# Altium schematic sheet Power.SchDoc
size A4; Organization: Altium Limited; Address1: 3 Minna Close; Address2: Belrose; Address3: NSW 2085; Address4: Australia
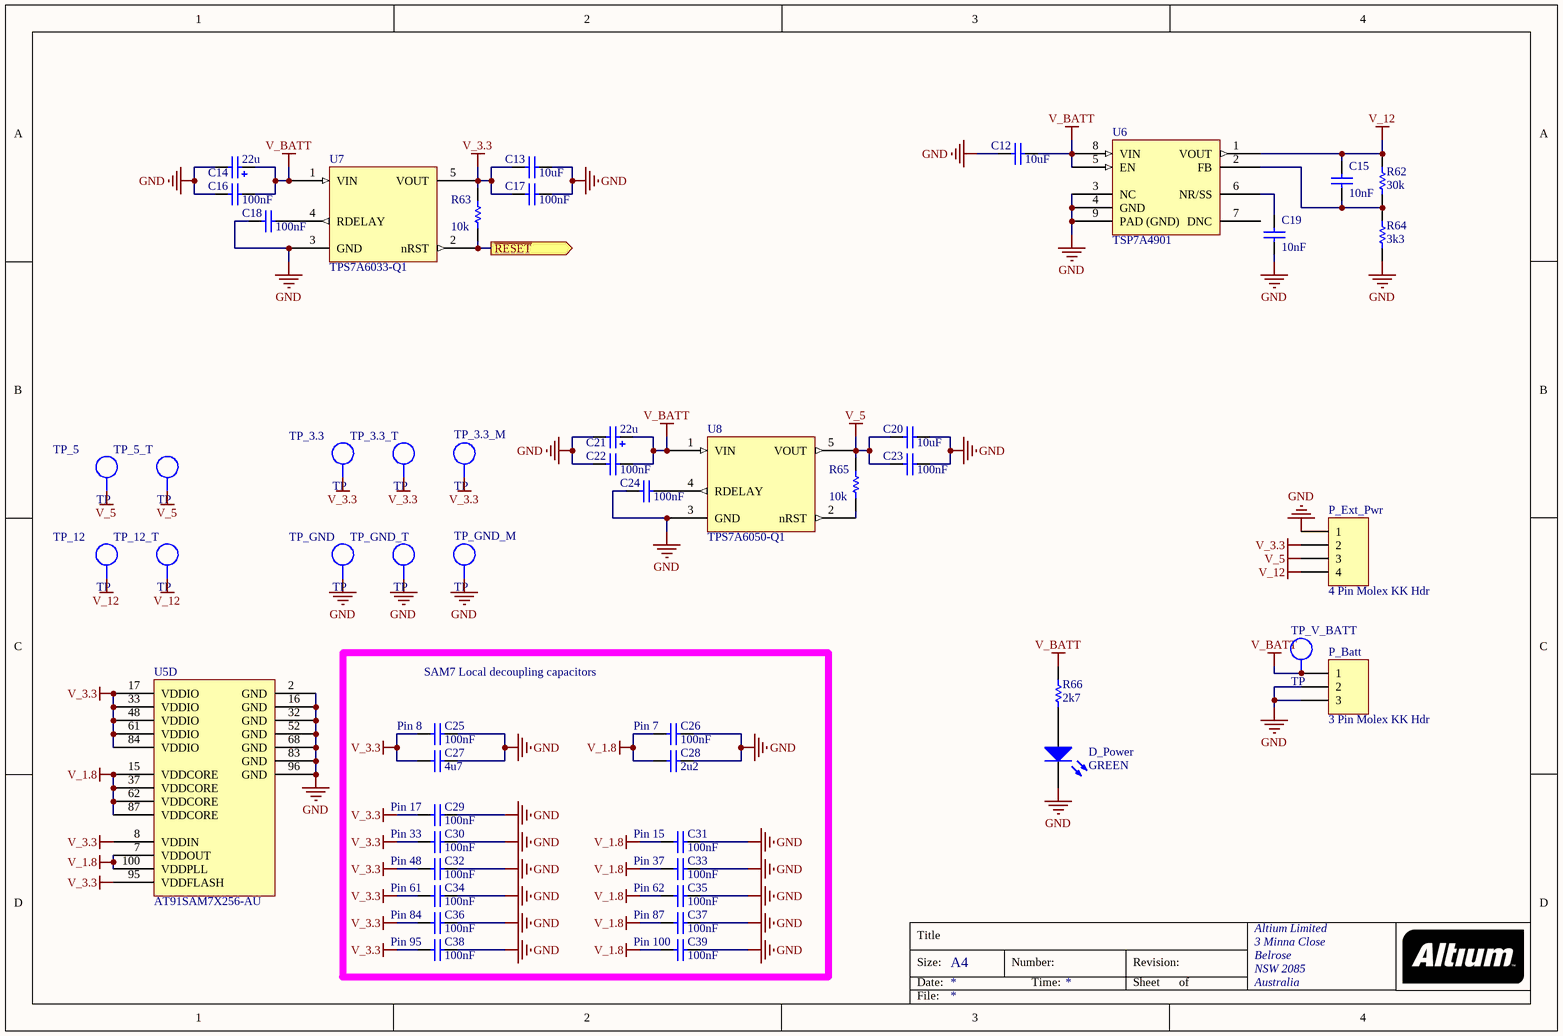
[diagram p0: Power.SchDoc]

## Parts
C12  10uF  [0805]
C13  10uF  [0805]
C14  value 22u  [6032]  (hidden comment: CP_TANT_22uF)
C15  10nF  [0603]
C16  100nF  [0603]
C17  100nF  [0603]
C18  100nF  [0603]
C19  10nF  [0603]
C20  10uF  [0805]
C21  value 22u  [6032]  (hidden comment: CP_TANT_22uF)
C22  100nF  [0603]
C23  100nF  [0603]
C24  100nF  [0603]
C25  100nF  [0603]
C26  100nF  [0603]
C27  4u7  [0603]
C28  2u2  [0603]
C29  100nF  [0603]
C30  100nF  [0603]
C31  100nF  [0603]
C32  100nF  [0603]
C33  100nF  [0603]
C34  100nF  [0603]
C35  100nF  [0603]
C36  100nF  [0603]
C37  100nF  [0603]
C38  100nF  [0603]
C39  100nF  [0603]
D_Power  value GREEN  [DIODE_0805]  (hidden comment: LED Green)
P_Batt  3 Pin Molex KK Hdr  [G_MOLEX_KK_3_HDR]
P_Ext_Pwr  4 Pin Molex KK Hdr  [G_MOLEX_KK_4_HDR]
R62  30k  [0603]
R63  10k  [0603]
R64  3k3  [0603]
R65  10k  [0603]
R66  2k7  [0603]
TP_3.3  TP  [TEST_POINT_4X2MM]  (no BOM)
TP_3.3_M  TP  [TEST_POINT_4X2MM]  (no BOM)
TP_3.3_T  TP  [TEST_POINT_4X2MM]  (no BOM)
TP_5  TP  [TEST_POINT_4X2MM]  (no BOM)
TP_5_T  TP  [TEST_POINT_4X2MM]  (no BOM)
TP_12  TP  [TEST_POINT_4X2MM]  (no BOM)
TP_12_T  TP  [TEST_POINT_4X2MM]  (no BOM)
TP_GND  TP  [TEST_POINT_4X2MM]  (no BOM)
TP_GND_M  TP  [TEST_POINT_4X2MM]  (no BOM)
TP_GND_T  TP  [TEST_POINT_4X2MM]  (no BOM)
TP_V_BATT  TP  [TEST_POINT_4X2MM]  (no BOM)
U5  AT91SAM7X256-AU  [LQFP100_N]  (part D of 4)
U6  TSP7A4901  [TSOP65P490X110_HS-8N]
U7  TPS7A6033-Q1  [TO170P1524X483-6N]
U8  TPS7A6050-Q1  [TO170P1524X483-6N]

## Ports
~{RESET} (out)

## Nets
GND: C12.1 C13.2 C14.2 C16.1 C17.1 C18.1 C19.1 C20.2 C21.2 C22.1 C23.1 C24.1 C25.2 C26.2 C27.2 C28.2 C29.2 C30.2 C31.2 C32.2 C33.2 C34.2 C35.2 C36.2 C37.2 C38.2 C39.2 D_Power.2(K) P_Batt.2 P_Batt.3 P_Ext_Pwr.1 R64.1 TP_GND.1 TP_GND_M.1 TP_GND_T.1 U5.2(GND) U5.16(GND) U5.32(GND) U5.52(GND) U5.68(GND) U5.83(GND) U5.96(GND) U6.3(NC) U6.4(GND) U6.9(PAD_(GND)) U7.3(GND) U8.3(GND)
V_1.8: C26.1 C28.1 C31.1 C33.1 C35.1 C37.1 C39.1 U5.7(VDDOUT) U5.15(VDDCORE) U5.37(VDDCORE) U5.62(VDDCORE) U5.87(VDDCORE) U5.100(VDDPLL)
V_3.3: C13.1 C17.2 C25.1 C27.1 C29.1 C30.1 C32.1 C34.1 C36.1 C38.1 P_Ext_Pwr.2 R63.2 TP_3.3.1 TP_3.3_M.1 TP_3.3_T.1 U5.8(VDDIN) U5.17(VDDIO) U5.33(VDDIO) U5.48(VDDIO) U5.61(VDDIO) U5.84(VDDIO) U5.95(VDDFLASH) U7.5(VOUT)
V_5: C20.1 C23.2 P_Ext_Pwr.3 R65.2 TP_5.1 TP_5_T.1 U8.5(VOUT)
V_12: C15.2 P_Ext_Pwr.4 R62.2 TP_12.1 TP_12_T.1 U6.1(VOUT)
V_BATT: C12.2 C14.1 C16.2 C21.1 C22.2 P_Batt.1 R66.2 TP_V_BATT.1 U6.5(EN) U6.8(VIN) U7.1(VIN) U8.1(VIN)
~{RESET}: R63.1 U7.2(nRST) ; port ~{RESET}
NetC15_1: C15.1 R62.1 R64.2 U6.2(FB)
NetC18_2: C18.2 U7.4(RDELAY)
NetC19_2: C19.2 U6.6(NR/SS)
NetC24_2: C24.2 U8.4(RDELAY)
NetD_Power_1: D_Power.1(A) R66.1
NetR65_1: R65.1 U8.2(nRST)

Not connected (* = marked no-connect by the designer): U6 7(DNC)

## Notes on the sheet
- SAM7 Local decoupling capacitors
- (near C25) Pin 8
- (near C26) Pin 7
- (near C29) Pin 17
- (near C30) Pin 33
- (near C31) Pin 15
- (near C32) Pin 48
- (near C34) Pin 61
- (near C36) Pin 84
- (near C33) Pin 37
- (near C35) Pin 62
- (near C37) Pin 87
- (near C38) Pin 95
- (near C39) Pin 100
- Title
- Size:
- Date:
- A4
- Number:
- Time:
- Revision:
- Sheet
- of
- File:

## Library data of the parts
C12 C13 C20 = CP_10uF 0805: CAP 10uF 10% 10V X5R 0805; Manufacturer: Murata; Manufacturer PN: GRM219R61A106KE44D; LatestRevisionDate: 29 May 08; Supplier 1: Digi-Key; Supplier Part Number 1: 490-4735-1-ND; Value: 10uF; Part Number: CP_10uF 0805; Component Kind: Standard; Component Type: Standard; Designator: CP_10uF 0805; Pin Count: 2
C14 C21 = CP_TANT_22uF_35V: CAP TANT 22UF 35V 10% SMD; Manufacturer: Vishay; Manufacturer PN: 293D226X9035D2TE3; Verify: NOT CHECKED; Signal Integrity: Cap Pol; Latest Revision Date: 20 Feb 09; Supplier 1: Digi-Key; Supplier Part Number 1: 718-1071-1-ND; Part Number: CP_TANT_22uF_35V; Component Kind: Standard; Component Type: Standard; Designator: CP_TANT_22uF_35V; Pin Count: 2; Simulation: CAP
C15 C19 = CP_10nF 0603: CAP CER 10000PF 100V X7R 0603; Manufacturer: Taiyo Yuden; Manufacturer PN: HMK107B7103KA-T; Supplier 1: Digi-Key; Supplier Part Number 1: 587-1446-2-ND; Value: 10nF; Part Number: CP_10nF 0603; Component Kind: Standard; Component Type: Standard; Designator: CP_10nF 0603; Pin Count: 2; Signal Integrity: Cap; Simulation: CAP
C16-C18 C22-C26 C29-C39 = CP_100nF 0603: CAP CER .10UF 50V X5R 0603; Manufacturer: Taiyo Yuden; Manufacturer PN: UMK107B7104KA-T; Value: 100nF; Part Number: CP_100nF 0603; Component Kind: Standard; Component Type: Standard; Designator: CP_100nF 0603; Pin Count: 2; LatestRevisionDate: 29 May 08; Supplier 1: Digi-Key; Supplier Part Number 1: 478-6206-1-ND; Signal Integrity: Cap; Simulation: CAP
C27 = CP_4u7 0603: CAP CER 4.7UF 10V X5R 0603; Manufacturer: Taiyo Yuden LMK107BJ475KA-T; Value: 4u7; Part Number: CP_4u7 0603; Component Kind: Standard; Component Type: Standard; Designator: CP_4u7 0603; Pin Count: 2; LatestRevisionDate: 29 May 08; Supplier 1: Digi-Key; Supplier Part Number 1: 587-1441-1-ND; Simulation: CAP
C28 = CP_2u2F_10V_0603: CAP CER 2.2UF 10V 10% X5R 0603; Manufacturer: Murata Electronics North America; Manufacturer PN: GRM188R61A225KE34D; Verify: not verified; Value: 2u2; Part Number: CP_2u2F_10V_0603; Component Kind: Standard; Component Type: Standard; Designator: CP_2u2F_10V_0603; Pin Count: 2; LatestRevisionDate: 20 Feb 08; Supplier 1: Digi-Key; Supplier Part Number 1: 490-1545-1-ND; Signal Integrity: Cap; Simulation: CAP
D_Power = DL_LED Green 0805: Green LED 0805; Manufacturer: Vishay; Verify: Not checked; Supplier 1: Digi-Key; Supplier Part Number 1: 160-1179-2-ND; Part Number: DL_LED Green 0805; Component Kind: Standard; Component Type: Standard; Designator: DL_LED Green 0805; Footprint: LED_RA_SMD; Pin Count: 2; Simulation: LED0
P_Batt = JP_MOLEX_KK_3POS: CONN HEADER 3POS .100 VERT TIN; Manufacturer: Molex/Waldom; Signal Integrity: Connector; Manufacturer PN: 22-23-2031; Supplier 1: Digi-Key; Supplier Part Number 1: WM4201-ND; Value: 3 Pin Molex KK Hdr; Part Number: JP_MOLEX_KK_3POS; Component Kind: Standard; Component Type: Standard; Designator: JP_MOLEX_KK_3POS; Pin Count: 3
P_Ext_Pwr = JP_MOLEX_KK_4POS: CONN HEADER 4POS .100 VERT TIN; Manufacturer: Molex/Waldom; Signal Integrity: Connector; Manufacturer PN: 22-23-2041; Supplier 1: Digi-Key; Supplier Part Number 1: WM4202-ND; Value: 4 Pin Molex KK Hdr; Part Number: JP_MOLEX_KK_4POS; Component Kind: Standard; Component Type: Standard; Designator: JP_MOLEX_KK_4POS; Pin Count: 4
R62 = RS_30k 0603: RES 30K OHM 1/10W 1% 0603 SMD; Manufacturer: Yageo; Manufacturer PN: RC0603FR-0730KL; LatestRevisionDate: 6 May 2011; Supplier 1: Digi-Key; Supplier Part Number 1: 311-30.0KHRTR-ND; Value: 30k; Part Number: RS_30k 0603; Component Kind: Standard; Component Type: Standard; Designator: RS_30k 0603; Pin Count: 2; Signal Integrity: Res; Simulation: RESISTOR
R63 R65 = RS_10k 0603: RES 10.0K OHM 1/10W 1% 0603 SMD; Manufacturer: Yageo; Manufacturer PN: RC0603FR-0710KL; LatestRevisionDate: 29 May 08; Supplier 1: Digi-Key; Supplier Part Number 1: 311-10.0KHRTR-ND; Value: 10k; Part Number: RS_10k 0603; Component Kind: Standard; Component Type: Standard; Designator: RS_10k 0603; Pin Count: 2; Signal Integrity: Res; Simulation: RESISTOR
R64 = RS_3k3 0603: RES 3.3K OHM 1/10W 5% 0603 SMD; Manufacturer: Yageo; Manufacturer PN: RC0603JR-073K3L; LatestRevisionDate: 1 Jun 08; Supplier 1: Digi-Key; Supplier Part Number 1: 311-3.3KGRTR-ND; Value: 3k3; Part Number: RS_3k3 0603; Component Kind: Standard; Component Type: Standard; Designator: RS_3k3 0603; Pin Count: 2; Signal Integrity: Res; Simulation: RESISTOR
R66 = RS_2k7 0603: RES 2.7K OHM 1/10W 5% 0603 SMD; Manufacturer: Yageo; Manufacturer PN: RC0603JR-072K7L; LatestRevisionDate: 6 May 2011; Supplier 1: Digi-Key; Supplier Part Number 1: 311-2.7KGRTR-ND; Value: 2k7; Part Number: RS_2k7 0603; Component Kind: Standard; Component Type: Standard; Designator: RS_2k7 0603; Pin Count: 2; Signal Integrity: Res; Simulation: RESISTOR
TP_3.3 TP_3.3_M TP_3.3_T TP_5 TP_5_T TP_12 TP_12_T TP_GND TP_GND_M TP_GND_T TP_V_BATT = TP_TESTPOINT: Test-Point; LatestRevisionDate: 29 May 08; Manufacturer PN: *; Manufacturer: *; Supplier 1: Digi-Key; Supplier Part Number 1: 5016KTR-ND; Value: TP; Part Number: TP_TESTPOINT; Component Type: Standard (No BOM); Designator: TP_TESTPOINT; Pin Count: 1
U5 = AT91SAM7X256-AU: Smart ARM Microcontroller, ARM7TDMI 32-Bit RISC CPU, 256KB Flash and 64KB SRAM, 100-Pin LQFP, Industrial, Pb-Free; Published: 16-Oct-2006; DatasheetVersion: 17-Oct-2005; PackageVersion: Apr-2006; PackageReference: LQFP100; Publisher: Altium Limited; PackageDescription: 100-Pin Thin Quad Flat Pack 0.5 mm Pitch; Code_JEDEC: MS-026-BED; ComponentLink1Description: Manufacturer Link; ComponentLink1URL: http://www.atmel.com; ComponentLink2Description: Datasheet; ComponentLink2URL: http://www.atmel.com/dyn/resources/prod_documents/6120s.pdf
U6 = TSP7A4901: Supplier 1: TI Samples; Supplier Part Number 1: TSP7A4901
U7 = TPS7A6033-Q1: Supplier 1: TI Samples; Supplier Part Number 1: TPS7A6033-Q1
U8 = TPS7A6050-Q1: Supplier 1: TI Samples; Supplier Part Number 1: TPS7A6050-Q1